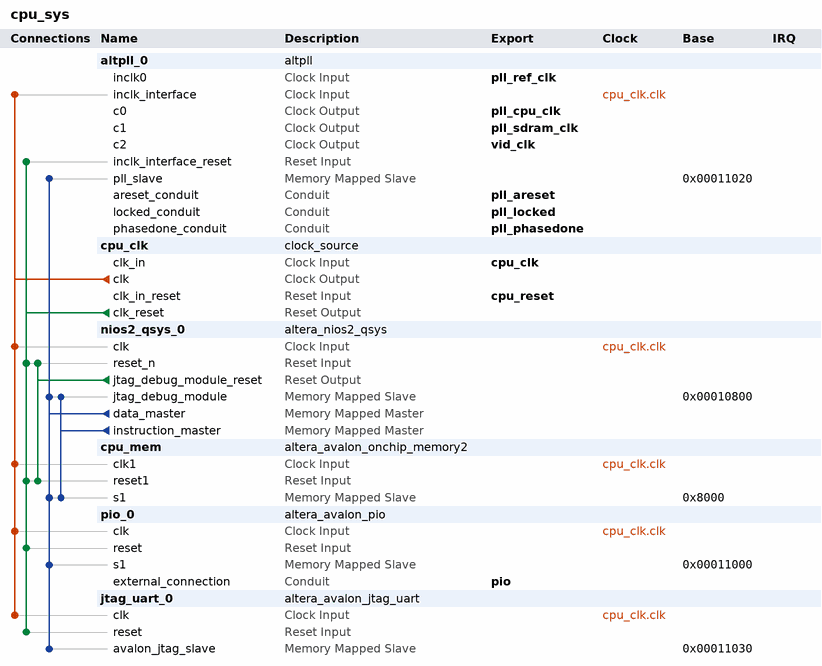
[diagram p0: system contents]
# Platform Designer (Qsys) system cpu_sys, Cyclone IV E EP4CE30F23C6
# Parameters at their usual value, and those the tool derives, are not listed.
package require -exact qsys 13.0.1.99.2
create_system cpu_sys
set_project_property DEVICE_FAMILY {Cyclone IV E}
set_project_property DEVICE EP4CE30F23C6

add_instance altpll_0 altpll 13.0
set_instance_parameter_value altpll_0 INCLK0_INPUT_FREQUENCY 40000
set_instance_parameter_value altpll_0 CLK0_MULTIPLY_BY 4
set_instance_parameter_value altpll_0 CLK1_MULTIPLY_BY 4
set_instance_parameter_value altpll_0 CLK2_MULTIPLY_BY 1
set_instance_parameter_value altpll_0 CLK0_DIVIDE_BY 5
set_instance_parameter_value altpll_0 CLK1_DIVIDE_BY 1
set_instance_parameter_value altpll_0 CLK2_DIVIDE_BY 1
set_instance_parameter_value altpll_0 CLK1_PHASE_SHIFT 0
set_instance_parameter_value altpll_0 CLK2_PHASE_SHIFT 0
set_instance_parameter_value altpll_0 CLK1_DUTY_CYCLE 50
set_instance_parameter_value altpll_0 CLK2_DUTY_CYCLE 50
set_instance_parameter_value altpll_0 PORT_clk1 PORT_USED
set_instance_parameter_value altpll_0 PORT_clk2 PORT_USED
set_instance_parameter_value altpll_0 PORT_clk3 PORT_UNUSED
set_instance_parameter_value altpll_0 PORT_ARESET PORT_USED
set_instance_parameter_value altpll_0 PORT_LOCKED PORT_USED
set_instance_parameter_value altpll_0 AVALON_USE_SEPARATE_SYSCLK YES

add_instance cpu_clk clock_source 13.0
set_instance_parameter_value cpu_clk clockFrequency 20000000
set_instance_parameter_value cpu_clk resetSynchronousEdges DEASSERT

add_instance nios2_qsys_0 altera_nios2_qsys 13.0
set_instance_parameter_value nios2_qsys_0 resetSlave cpu_mem.s1
set_instance_parameter_value nios2_qsys_0 mmu_TLBMissExcSlave None
set_instance_parameter_value nios2_qsys_0 exceptionSlave cpu_mem.s1
set_instance_parameter_value nios2_qsys_0 breakSlave nios2_qsys_0.jtag_debug_module
set_instance_parameter_value nios2_qsys_0 impl Tiny
set_instance_parameter_value nios2_qsys_0 icache_size 4096

add_instance cpu_mem altera_avalon_onchip_memory2 13.0.1.99.2
set_instance_parameter_value cpu_mem dataWidth 32
set_instance_parameter_value cpu_mem dualPort false
set_instance_parameter_value cpu_mem initMemContent true
set_instance_parameter_value cpu_mem initializationFileName cpu_mem.hex
set_instance_parameter_value cpu_mem memorySize 32768
set_instance_parameter_value cpu_mem useNonDefaultInitFile true

add_instance pio_0 altera_avalon_pio 13.0.1.99.2
set_instance_parameter_value pio_0 bitModifyingOutReg true
set_instance_parameter_value pio_0 captureEdge true
set_instance_parameter_value pio_0 direction InOut
set_instance_parameter_value pio_0 width 32

add_instance jtag_uart_0 altera_avalon_jtag_uart 13.0.1.99.2
set_instance_parameter_value jtag_uart_0 simInteractiveOptions NO_INTERACTIVE_WINDOWS

# connections
add_connection cpu_clk.clk altpll_0.inclk_interface clock
add_connection cpu_clk.clk cpu_mem.clk1 clock
add_connection cpu_clk.clk jtag_uart_0.clk clock
add_connection cpu_clk.clk nios2_qsys_0.clk clock
add_connection cpu_clk.clk pio_0.clk clock
add_connection cpu_clk.clk_reset altpll_0.inclk_interface_reset reset
add_connection cpu_clk.clk_reset cpu_mem.reset1 reset
add_connection cpu_clk.clk_reset jtag_uart_0.reset reset
add_connection cpu_clk.clk_reset nios2_qsys_0.reset_n reset
add_connection cpu_clk.clk_reset pio_0.reset reset
add_connection nios2_qsys_0.jtag_debug_module_reset cpu_mem.reset1 reset
add_connection nios2_qsys_0.jtag_debug_module_reset nios2_qsys_0.reset_n reset
add_connection nios2_qsys_0.data_master altpll_0.pll_slave avalon
set_connection_parameter_value nios2_qsys_0.data_master/altpll_0.pll_slave baseAddress 0x00011020
add_connection nios2_qsys_0.data_master cpu_mem.s1 avalon
set_connection_parameter_value nios2_qsys_0.data_master/cpu_mem.s1 baseAddress 0x8000
add_connection nios2_qsys_0.data_master jtag_uart_0.avalon_jtag_slave avalon
set_connection_parameter_value nios2_qsys_0.data_master/jtag_uart_0.avalon_jtag_slave baseAddress 0x00011030
add_connection nios2_qsys_0.data_master nios2_qsys_0.jtag_debug_module avalon
set_connection_parameter_value nios2_qsys_0.data_master/nios2_qsys_0.jtag_debug_module baseAddress 0x00010800
add_connection nios2_qsys_0.data_master pio_0.s1 avalon
set_connection_parameter_value nios2_qsys_0.data_master/pio_0.s1 baseAddress 0x00011000
add_connection nios2_qsys_0.instruction_master cpu_mem.s1 avalon
set_connection_parameter_value nios2_qsys_0.instruction_master/cpu_mem.s1 baseAddress 0x8000
add_connection nios2_qsys_0.instruction_master nios2_qsys_0.jtag_debug_module avalon
set_connection_parameter_value nios2_qsys_0.instruction_master/nios2_qsys_0.jtag_debug_module baseAddress 0x00010800

# exported interfaces
add_interface pll_sdram_clk clock source
set_interface_property pll_sdram_clk EXPORT_OF altpll_0.c1
add_interface vid_clk clock source
set_interface_property vid_clk EXPORT_OF altpll_0.c2
add_interface pll_areset conduit end
set_interface_property pll_areset EXPORT_OF altpll_0.areset_conduit
add_interface pll_phasedone conduit end
set_interface_property pll_phasedone EXPORT_OF altpll_0.phasedone_conduit
add_interface pio conduit end
set_interface_property pio EXPORT_OF pio_0.external_connection
add_interface pll_locked conduit end
set_interface_property pll_locked EXPORT_OF altpll_0.locked_conduit
add_interface pll_ref_clk clock sink
set_interface_property pll_ref_clk EXPORT_OF altpll_0.inclk0
add_interface cpu_reset reset sink
set_interface_property cpu_reset EXPORT_OF cpu_clk.clk_in_reset
add_interface pll_cpu_clk clock source
set_interface_property pll_cpu_clk EXPORT_OF altpll_0.c0
add_interface cpu_clk clock sink
set_interface_property cpu_clk EXPORT_OF cpu_clk.clk_in

set_interconnect_requirement {$system} qsys_mm.clockCrossingAdapter HANDSHAKE
set_interconnect_requirement {$system} qsys_mm.maxAdditionalLatency 1

save_system cpu_sys.qsys
